# Altium schematic sheet KF2EDG.SchDoc
size A4
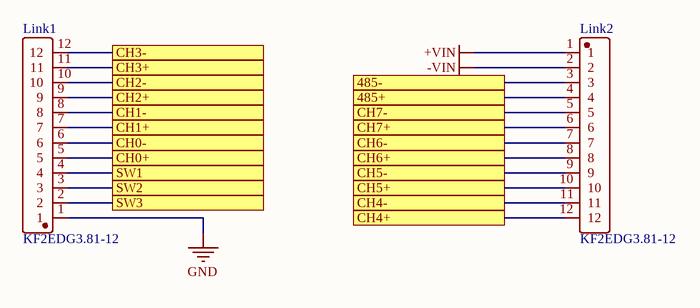
[diagram p0: KF2EDG.SchDoc]

## Parts
Link1  KF2EDG3.81-12  [CONN-TH_12P-P3.81_KF2EDGV-3.81-12P]
Link2  KF2EDG3.81-12  [CONN-TH_12P-P3.81_KF2EDGV-3.81-12P]

## Ports
485+, 485-, CH0+, CH0-, CH1+, CH1-, CH2+, CH2-, CH3+, CH3-, CH4+, CH4-, CH5+, CH5-, CH6+, CH6-, CH7+, CH7-, SW1, SW2, SW3

## Nets
+VIN: Link2.1
-VIN: Link2.2
GND: Link1.1
485+: Link2.4 ; port 485+
485-: Link2.3 ; port 485-
CH0+: Link1.5 ; port CH0+
CH0-: Link1.6 ; port CH0-
CH1+: Link1.7 ; port CH1+
CH1-: Link1.8 ; port CH1-
CH2+: Link1.9 ; port CH2+
CH2-: Link1.10 ; port CH2-
CH3+: Link1.11 ; port CH3+
CH3-: Link1.12 ; port CH3-
CH4+: Link2.12 ; port CH4+
CH4-: Link2.11 ; port CH4-
CH5+: Link2.10 ; port CH5+
CH5-: Link2.9 ; port CH5-
CH6+: Link2.8 ; port CH6+
CH6-: Link2.7 ; port CH6-
CH7+: Link2.6 ; port CH7+
CH7-: Link2.5 ; port CH7-
SW1: Link1.4 ; port SW1
SW2: Link1.3 ; port SW2
SW3: Link1.2 ; port SW3